# EAGLE design konashi_rev105 (EAGLE 6.3)
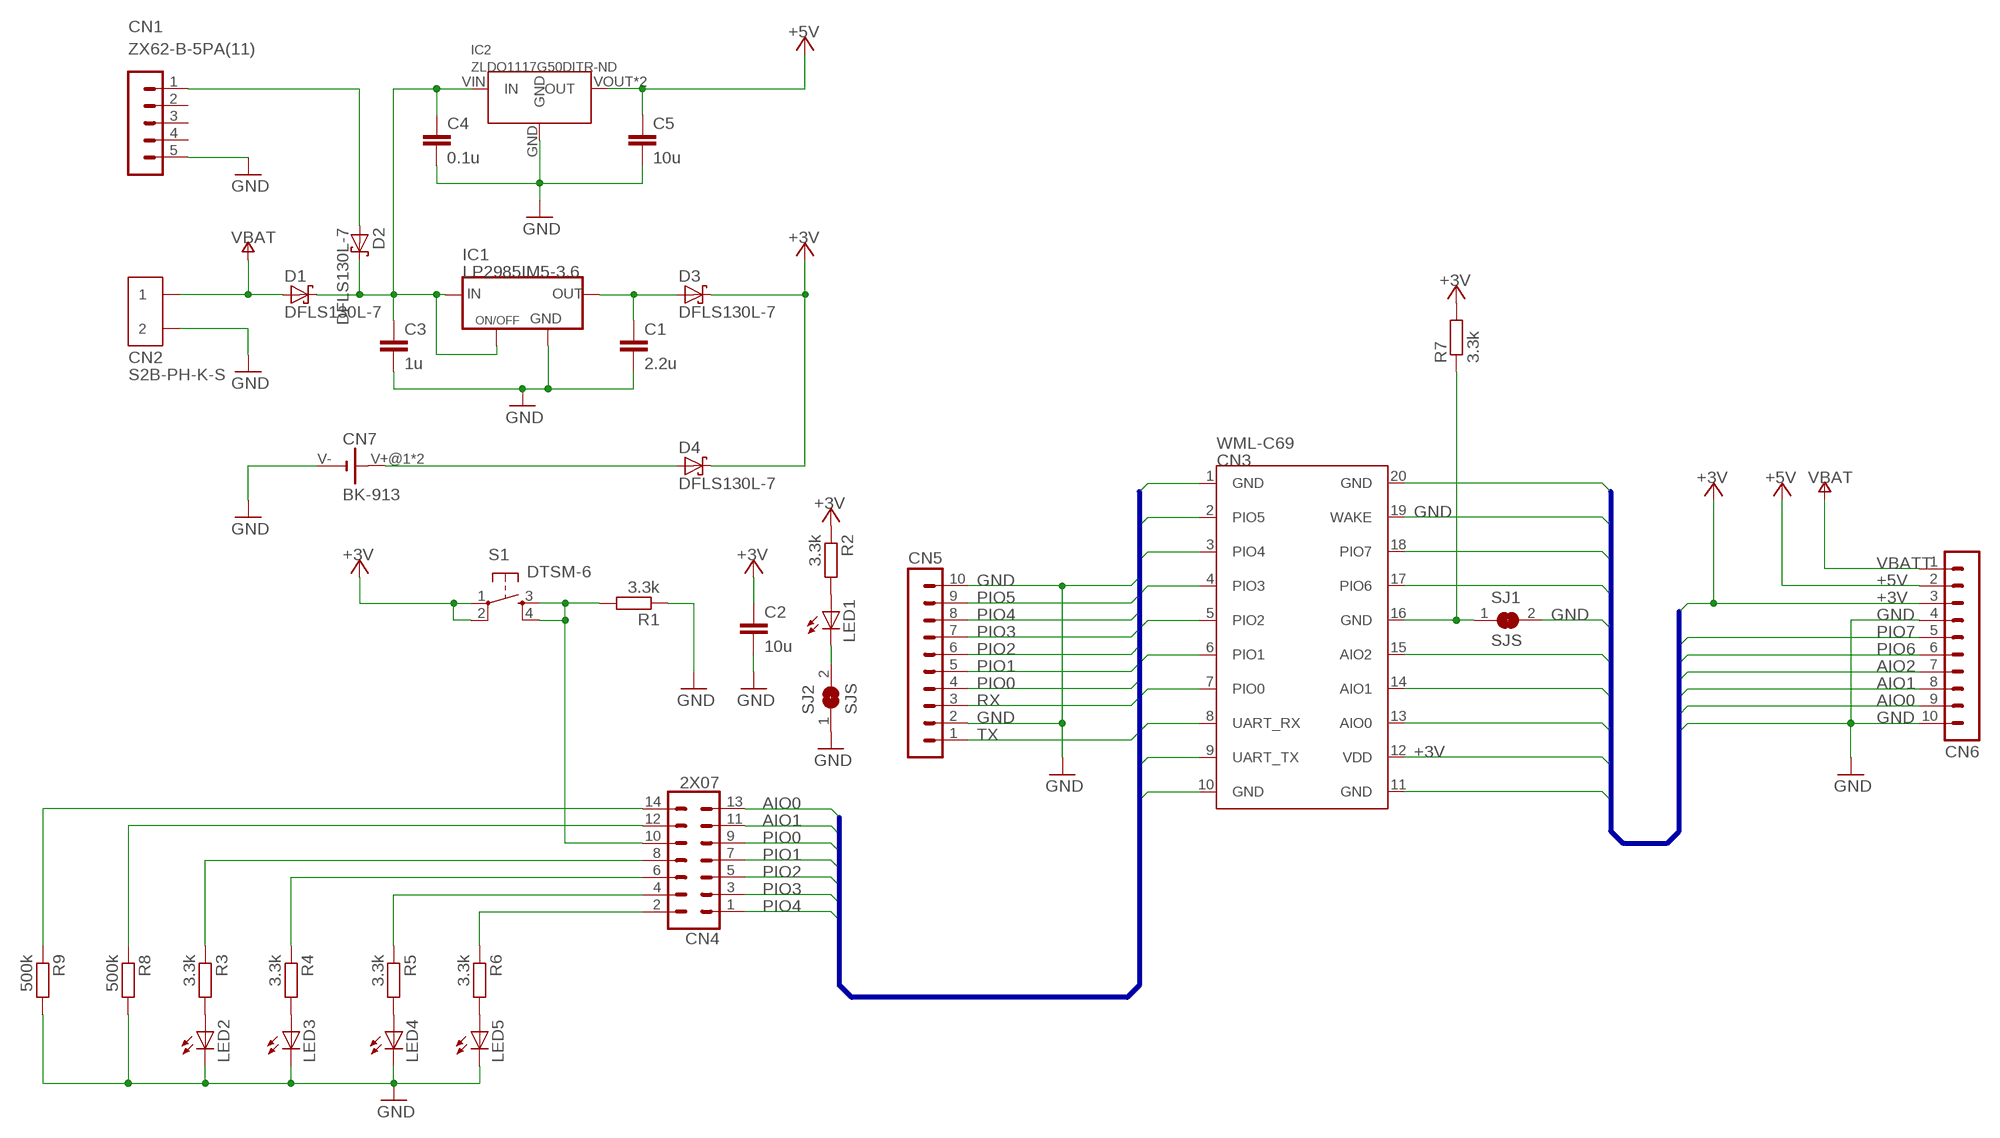
[diagram p0: schematic, sheet 1]

## Parts
C1  2.2u  C-EUC0603  [C0603]
C2  10u  C-EUC0603  [C0603]
C3  1u  C-EUC0603  [C0603]
C4  0.1u  C-EUC0603  [C0603]
C5  10u  C-EUC0603  [C0603]
CN1  ZX62-B-5PA(11)  [MICRO-B]
CN2  S2B-PH-K-S  [S2B-PH-K-S]
CN3  WML-C69  [WML-C69]
CN4  2X07  [2X07]
CN5  MA10-1  [MA10-1]
CN6  MA10-1  [MA10-1]
CN7  BK-913  [BK-913]
D1  DFLS130L-7  [DFLS130L]
D2  DFLS130L-7  [DFLS130L]
D3  DFLS130L-7  [DFLS130L]
D4  DFLS130L-7  [DFLS130L]
IC1  LP2985IM5-3.6  LP2981-30DBVR  [SOT-23]
IC2  ZLDO1117G50DITR-ND  [SOD233]
LED1  LEDCHIPLED_1206  [CHIPLED_1206]
LED2  LEDCHIPLED_1206  [CHIPLED_1206]
LED3  LEDCHIPLED_1206  [CHIPLED_1206]
LED4  LEDCHIPLED_1206  [CHIPLED_1206]
LED5  LEDCHIPLED_1206  [CHIPLED_1206]
R1  3.3k  R-EU_R0603  [R0603]
R2  3.3k  R-EU_R0603  [R0603]
R3  3.3k  R-EU_R0603  [R0603]
R4  3.3k  R-EU_R0603  [R0603]
R5  3.3k  R-EU_R0603  [R0603]
R6  3.3k  R-EU_R0603  [R0603]
R7  3.3k  R-EU_R0603  [R0603]
R8  500k  R-EU_R0603  [R0603]
R9  500k  R-EU_R0603  [R0603]
S1  DTSM-6  [DTSM-6]
SJ1  SJS  [SJS]
SJ2  SJS  [SJS]

## Nets
+3V: C2.1 CN3.12(VDD) CN6.3 D3.C D4.C R2.1 R7.2 S1.1 S1.2
+5V: C5.1 CN6.2 IC2.VOUT2(OUT) IC2.VOUT(OUT)
AIO0: CN3.13(AIO0) CN4.13 CN6.9
AIO1: CN3.14(AIO1) CN4.11 CN6.8
AIO2: CN3.15(AIO2) CN6.7
GND: C1.2 C2.2 C3.2 C4.2 C5.2 CN1.5(5.GND) CN2.P$2 CN3.1(GND) CN3.10(GND) CN3.11(GND) CN3.19(WAKE) CN3.20(GND) CN5.2 CN5.10 CN6.4 CN6.10 CN7.V-(-) IC1.2(GND) IC2.GND LED2.C LED3.C LED4.C LED5.C R1.1 R8.2 R9.2 SJ1.2 SJ2.1
N$1: LED3.A R4.2
N$2: LED2.A R3.2
N$3: LED1.C SJ2.2
N$4: CN7.V+@1(+) CN7.V+@2(+) D4.A
N$5: CN3.16(GND) R7.1 SJ1.1
N$6: C1.1 D3.A IC1.5(OUT)
N$7: CN4.12 R8.1
N$8: C3.1 C4.1 D1.C D2.C IC1.1(IN) IC1.3(ON/OFF) IC2.VIN(IN)
N$9: LED5.A R6.2
N$10: LED4.A R5.2
N$11: CN4.14 R9.1
N$13: LED1.A R2.2
N$18: CN4.10 R1.2 S1.3 S1.4
N$20: CN4.6 R4.1
N$21: CN4.2 R6.1
N$22: CN4.4 R5.1
N$23: CN4.8 R3.1
N$37: CN1.1(1.VBUS) D2.A
PIO0: CN3.7(PIO0) CN4.9 CN5.4
PIO1: CN3.6(PIO1) CN4.7 CN5.5
PIO2: CN3.5(PIO2) CN4.5 CN5.6
PIO3: CN3.4(PIO3) CN4.3 CN5.7
PIO4: CN3.3(PIO4) CN4.1 CN5.8
PIO5: CN3.2(PIO5) CN5.9
PIO6: CN3.17(PIO6) CN6.6
PIO7: CN3.18(PIO7) CN6.5
RX: CN3.8(UART_RX) CN5.3
TX: CN3.9(UART_TX) CN5.1
VBATT: CN2.P$1 CN6.1 D1.A ; supply symbol labelled VBAT
Unconnected: CN1.2(2.D-) CN1.3(3.D+) CN1.4(4.ID)

## Buses
GND,PIO[0..5],RX,TX
GND,PIO7,PIO6,AIO2,AIO1,AIO0,+3V

## Library data of the parts
C1-C5 = rcl:C-EU: CAPACITOR, European symbol
CN1 = con-USB:ZX62-B-5PA(11)
CN2 = con-jst:S2B-PH-K-S
CN3 = ble_CSR2:WML-C69
CN4 = konashi_rev105:2X07
CN5 CN6 = con-std:MA10-1: PIN HEADER; OC_FARNELL: unknown; OC_NEWARK: unknown
CN7 = con-CoinBatt:BK-913
D1-D4 = dioade:DFLS130L-7
IC1 = LDO:LP2981-30DBVR
IC2 = konashi_rev105:ZLDO1117G50DITR-ND
LED1-LED5 = led:LED: LED OSRAM: - CHIPLED LG R971, LG N971, LY N971, LG Q971, LY Q971, LO R971, LY R971 LH N974, LH R974 LS Q976, LO Q976, LY Q976 LO Q996 - Hyper CHIPLED LW Q18S LB Q993, LB Q99A, LB R99A - SideLED LS A670, LO A670, LY A670, LG A670, LP A670 LB A673, LV A673, LT A673, LW A673 LH A674 LY A675 LS A676, LA A676, LO A676, LY A676, LW A676 LS A679, LY A679, LG A679 - Hyper Micro SIDELED® LS Y876, LA Y876, LO Y876, LY Y876 LT Y87S - SmartLED LW L88C, LW L88S LB L89C, LB L89S, LG L890 LS L89K, LO L89K, LY L89K LS L896, LA L896, LO L896, LY L896 - TOPLED LS T670, LO T670, LY T670, LG T670, LP T670 LSG T670, LSP T670, LSY T670, LOP T670, LYG T670 LG T671, LOG T671, LSG T671 LB T673, LV T673, LT T673, LW T673 LH T674 LS T676, LA T676, LO T676, LY T676, LB T676, LH T676, LSB T676, LW T676 LB T67C, LV T67C, LT T67C, LS T67K, LO T67K, LY T67K, LW E67C LS E67B, LA E67B, LO E67B, LY E67B, LB E67C, LV E67C, LT E67C LW T67C LS T679, LY T679, LG T679 LS T770, LO T770, LY T770, LG T770, LP T770 LB T773, LV T773, LT T773, LW T773 LH T774 LS E675, LA E675, LY E675, LS T675 LS T776, LA T776, LO T776, LY T776, LB T776 LHGB T686 LT T68C, LB T68C - Hyper Mini TOPLED® LB M676 - Mini TOPLED Santana® LG M470 LS M47K, LO M47K, LY M47K Source: http://www.osram.convergy.de LUXEON: - LUMILED® LXK2-PW12-R00, LXK2-PW12-S00, LXK2-PW14-U00, LXK2-PW14-V00 LXK2-PM12-R00, LXK2-PM12-S00, LXK2-PM14-U00 LXK2-PE12-Q00, LXK2-PE12-R00, LXK2-PE12-S00, LXK2-PE14-T00, LXK2-PE14-U00 LXK2-PB12-K00, LXK2-PB12-L00, LXK2-PB12-M00, LXK2-PB14-N00, LXK2-PB14-P00, LXK2-PB14-Q00 LXK2-PR12-L00, LXK2-PR12-M00, LXK2-PR14-Q00, LXK2-PR14-R00 LXK2-PD12-Q00, LXK2-PD12-R00, LXK2-PD12-S00 LXK2-PH12-R00, LXK2-PH12-S00 LXK2-PL12-P00, LXK2-PL12-Q00, LXK2-PL12-R00 Source: www.luxeon.com KINGBRIGHT: KA-3528ASYC Source: www.kingbright.com
R1-R9 = rcl:R-EU_: RESISTOR, European symbol
S1 = switch-tact:DTSM-6
SJ1 SJ2 = pad:SJS

## Board
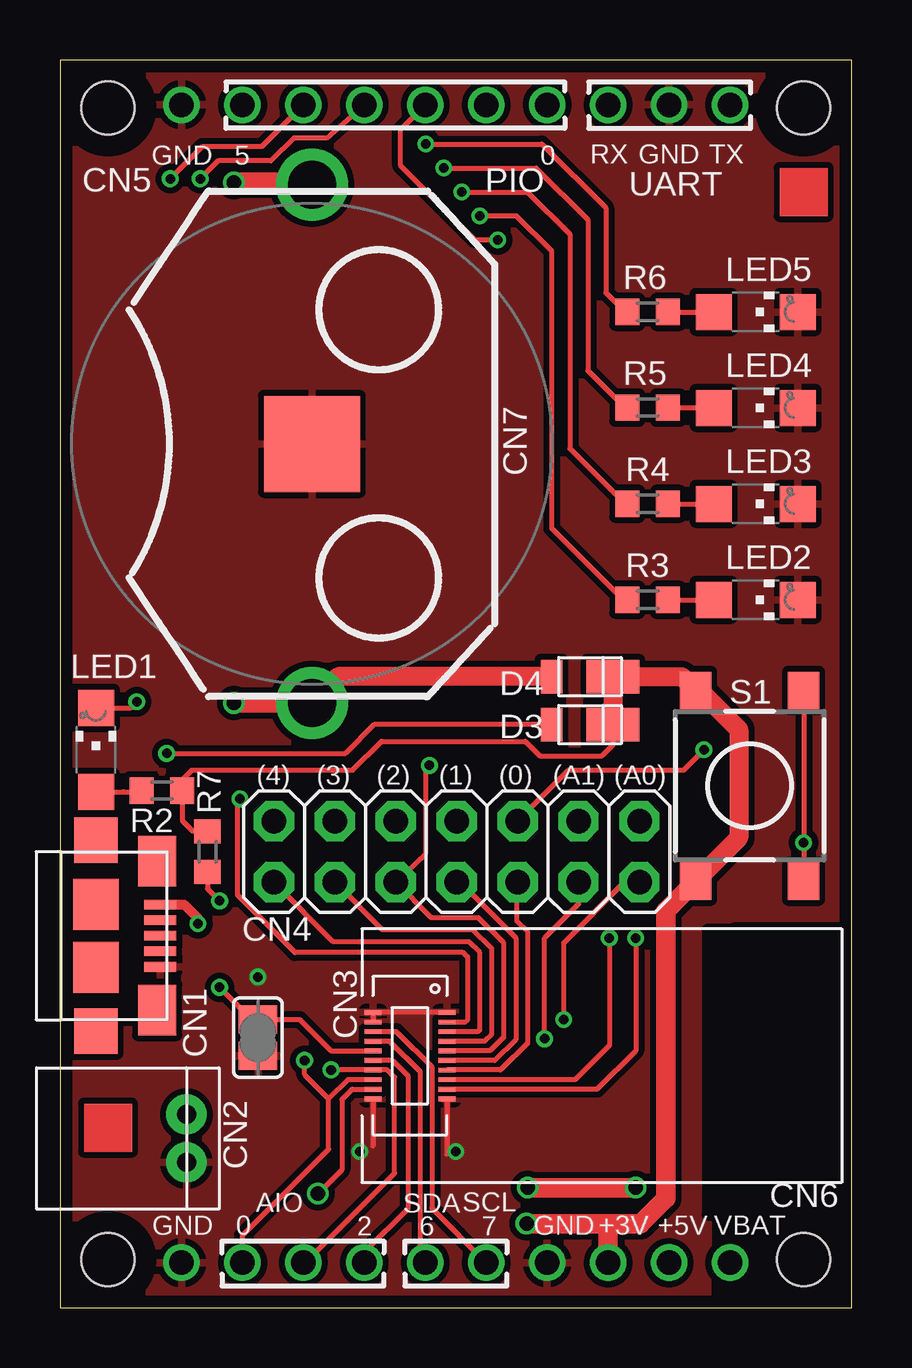
[diagram p1: board, top side]
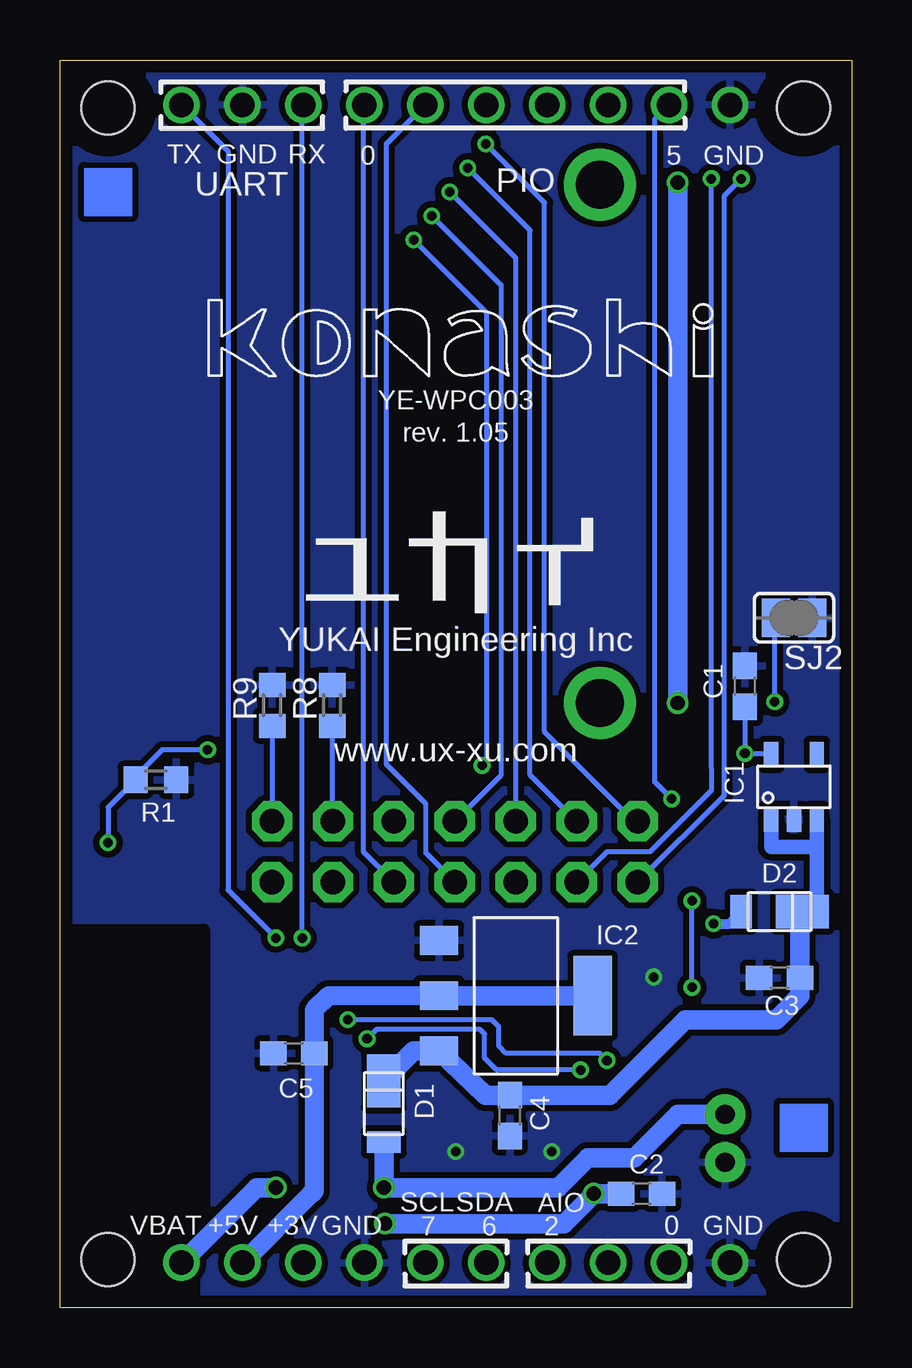
[diagram p2: board, bottom side, seen from below]

Size 33 x 52 mm. Coordinates in mm from the lower left corner, seen from the top.
Outline: 0,0 33,0 33,52 0,52 0,0
Copper layers (1*16): Top 0.035mm / dielectric 1.6mm / Bottom 0.035mm
Design rules "Elecrow_2-layer_PCB_eagle_rule": minimum track width 6mil, minimum drill 12mil, track to track 6mil, track to pad 6mil, pad to pad 6mil, via to via 8mil, smd to smd 0mil, copper to edge 20mil, drill to drill 10mil, minimum pad ring 6mil, minimum via ring 6mil, stop-mask expansion 0mil, vias tented up to drill 100mil, thermal gap 10mil
Holes 2.2 mm at 2,2 31,2 31,50 2,50
tRestrict: area 27,3.9 to 33,15.8; area 0.2,0.2 to 3.8,3.8; area 29.2,0.2 to 32.8,3.8; area 29.2,48.2 to 32.8,51.8; area 0.2,48.2 to 3.8,51.8
bRestrict: area 27,3.9 to 33,15.8; area 0.2,0.2 to 3.8,3.8; area 29.2,0.2 to 32.8,3.8; area 29.2,48.2 to 32.8,51.8; area 0.2,48.2 to 3.8,51.8

### Footprints (pad centres in the part's own frame; a part is rotated, then mirrored left to right if it is on the bottom)
C0603 = smd 1.1 x 1: 1 -0.85,0; 2 0.85,0
MICRO-B = smd 0.4 x 1.35: 1 -1.3,2.675; 2 -0.65,2.675; 3 0,2.675; 4 0.65,2.675; 5 1.3,2.675 | smd 2.1 x 1.6: P$1 3.1,2.55; P$2 -3.1,2.55 | smd 2.125 x 1.9: P$3 1.312,0; P$4 -1.312,0 | smd 1.9 x 1.8: P$5 3.975,0; P$6 -3.975,0
S2B-PH-K-S = drill 0.8 pad 1.676: P$1 1.95,-1.35; P$2 3.95,-1.35
WML-C69 = smd 0.2 x 0.7: 1 -1.8,1.54; 2 -1.4,1.54; 3 -1,1.54; 4 -0.6,1.54; 5 -0.2,1.54; 6 0.2,1.54; 7 0.6,1.54; 8 1,1.54; 9 1.4,1.54; 10 1.8,1.54; 11 1.8,-1.54; 12 1.4,-1.54; 13 1,-1.54; 14 0.6,-1.54; 15 0.2,-1.54; 16 -0.2,-1.54; 17 -0.6,-1.54; 18 -1,-1.54; 19 -1.4,-1.54; 20 -1.8,-1.54
2X07 = drill 1.016 pad 1.676 octagon: 1 -5.08,-1.27; 2 -5.08,1.27; 3 -2.54,-1.27; 4 -2.54,1.27; 5 0,-1.27; 6 0,1.27; 7 2.54,-1.27; 8 2.54,1.27; 9 5.08,-1.27; 10 5.08,1.27; 11 7.62,-1.27; 12 7.62,1.27; 13 10.16,-1.27; 14 10.16,1.27
MA10-1 = drill 1.016: 1 -11.43,0; 2 -8.89,0; 3 -6.35,0; 4 -3.81,0; 5 -1.27,0; 6 1.27,0; 7 3.81,0; 8 6.35,0; 9 8.89,0; 10 11.43,0
BK-913 = drill 2: V+@1 -10.8,0; V+@2 10.8,0 | smd 4 x 4: V- 0,0
DFLS130L = smd 0.9 x 1.4: A 1.6,0 | smd 2.2 x 1.4: C -0.95,0
SOT-23 = smd 0.6 x 1.05: 1 -0.95,-1.35; 2 0,-1.35; 3 0.95,-1.35; 4 0.95,1.35; 5 -0.95,1.35
SOD233 = smd 1.2 x 1.6: GND -2.3,-3.2; VIN 2.3,-3.2; VOUT 0,-3.2 | smd 3.3 x 1.6: VOUT2 0,3.2
CHIPLED_1206 = smd 1.5 x 1.5: A 0,-1.75; C 0,1.75
R0603 = smd 1 x 1.1: 1 -0.85,0; 2 0.85,0
DTSM-6 = smd 1.55 x 1.3: 1 -3.975,2.25; 2 3.975,2.25; 3 -3.975,-2.25; 4 3.975,-2.25
SJS = smd 1.168 x 1.6: 1 -0.762,0; 2 0.762,0

### Placement (x,y rotation side)
C1  4.44,25.9 90 bottom
C2  8.75,4.75 0 bottom
C3  3,13.75 180 bottom
C4  14.25,8 270 bottom
C5  23.25,10.6 180 bottom
CN1  1.5,15.5 270 top
CN2  6.62,10 270 top
CN3  14.59,10.5 270 top
CN4  14,19 0 top
CN5  16.5,50.13 180 top
CN6  16.5,1.87 180 top
CN7  10.5,36 270 top
D1  19.5,8.5 270 bottom
D2  3,16.5 180 bottom
D3  22.1,24.3 180 top
D4  22.1,26.3 180 top
IC1  2.4,21.7 0 bottom
IC2  14,13 270 bottom
LED1  1.5,23.25 0 top
LED2  29,29.5 270 top
LED3  29,33.5 270 top
LED4  29,37.5 270 top
LED5  29,41.5 270 top
R1  29,22 180 bottom
R2  4.25,21.55 180 top
R3  24.5,29.5 0 top
R4  24.5,33.5 0 top
R5  24.5,37.51 0 top
R6  24.5,41.5 0 top
R7  6.15,19 90 top
R8  21.65,25.1 90 bottom
R9  24.15,25.1 90 bottom
S1  28.75,21.75 90 top
SJ1  8.25,11.25 270 top
SJ2  2.4,28.75 180 bottom
U$13  [KONASHI_LOGO_WIRE]  16,40.1 0 bottom
U$14  [YUKAILOGO]  16.5,31.1 0 bottom

### Tracks (layer width: path | path; a pad name or v marks a point on that pad's centre or on a via)
+3V  (via drill 0.6)
  Top 0.2: R7.2 5.55,19.85 5.1,20.3 R2.1 5.1,22 5.5,22.4 12.2,22.4 13.4,23.6 19.4,23.6 20,23 22.6,23 23.05,23.45 D3.C
  Top 0.203: v10.75,4.75 11.75,5.75 11.75,8.67 12.18,9.1 CN3.12
  Top 0.8: S1.1 28.3,19.57 28.3,24.1 26.68,25.73 S1.2 25.93,26.3 D4.C D3.C
  Top 0.813: CN6.3 22.85,3.5 | 22.85,3.5 v19.45,3.5 | 22.85,3.5 24.19,3.5 25.25,4.56 25.25,16.52 S1.1
  Bottom 0.813: C2.1 v10.75,4.75 12,3.5 v19.45,3.5
+5V
  Bottom 0.8: IC2.VOUT 21.8,13 22.4,12.4 C5.1 22.4,4.86 22.53,4.73
  Bottom 0.813: IC2.VOUT IC2.VOUT2 | CN6.2 22.53,4.73 22.45,4.81
AIO0  (via drill 0.4)
  Top 0.2: CN3.13 12,9.5 11.2,8.7 | v10.2,10.3 10.2,9.7 11.2,8.7 | v21,12 21,15.2 23.53,17.73 CN4.13 | CN6.9 7.61,3.01 11.2,6.6 11.2,8.7
  Bottom 0.2: v10.2,10.3 10.5,10.6 14.4,10.6 14.7,10.9 14.7,11.7 15,12 v21,12
AIO1  (via drill 0.4)
  Top 0.2: v11.3,9.9 CN3.14 13.65,9.9 13.95,9.6 13.95,5.6 10.22,1.87 CN6.8 | v20.2,11.2 20.2,15.4 21.62,16.82 CN4.11
  Bottom 0.2: v11.3,9.9 14.8,9.9 15.3,10.4 15.3,11.4 15.5,11.6 19.8,11.6 v20.2,11.2
AIO2
  Top 0.203: CN6.7 12.69,2.31 14.5,4.12 14.5,9.66 13.86,10.3 CN3.15
GND  (via drill 0.4)
  Top 0.2: CN3.1 CN3.20
  Top 0.203: CN3.20 CN3.19 | CN3.11 13.05,6.73 | CN3.10 16.13,6.39
  other vias: 12.5,6.5 16.5,6.5 8.25,13.78
  pour Top (isolate 0.254): 0.25,51.75 32.75,51.75 32.75,15.75 27.12,15.75 27,0.25 0.25,0.25
  pour Bottom (isolate 0.254): 0.25,51.75 32.75,51.75 32.75,15.75 27.12,15.75 27,0.25 0.25,0.25
N$1
  Top 0.203: R4.2 LED3.A
N$2
  Top 0.203: R3.2 LED2.A
N$3  (via drill 0.4)
  Top 0.2: LED1.C 2.95,25 v3.2,25.25
  Bottom 0.2: v3.2,25.25 3.2,28.71 SJ2.2
N$4  (via drill 0.6)
  Top 0.8: D4.A 11.6,26.3 CN7.V+@2 v7.25,25.2
  Top 0.813: v7.25,46.9 10.4,46.9 CN7.V+@1
  Bottom 0.813: v7.25,25.2 v7.25,46.9
N$5  (via drill 0.4)
  Top 0.2: R7.1 6.15,17.45 v6.65,16.95
  Top 0.203: v6.65,13.35 7.99,12.01 SJ1.1 10,12 11.31,10.69 11.32,10.7 CN3.16
  Bottom 0.203: v6.65,13.35 v6.65,16.95
N$6  (via drill 0.4)
  Top 0.2: v4.45,23.1 11.9,23.1 13.1,24.3 D3.A
  Bottom 0.2: IC1.5 3.4,23.1 v4.45,23.1 v4.44,23.11 C1.1
N$7
  Bottom 0.2: R8.1 21.65,20.3 CN4.12
N$8
  Bottom 0.61: 1.8,16.5 D2.C 1.45,16.5 1.45,19.2 | IC1.3 1.45,19.2 | IC1.1 3.35,19.2 1.45,19.2
  Bottom 0.813: D2.C 2.15,16.5 C3.1 2.15,12.99 3.14,12 6.92,12 10.07,8.85 C4.1 15.26,8.85 IC2.VIN 18.26,10.69 D1.C
N$9
  Top 0.203: R6.2 LED5.A
N$10
  Top 0.203: R5.2 LED4.A
N$11
  Bottom 0.2: R9.1 CN4.14
N$13
  Top 0.2: 2.65,21.5 3.35,21.5 R2.2
  Top 0.203: LED1.A 2.65,21.5
N$18  (via drill 0.4)
  Top 0.2: CN4.10 21.2,22.4 26,22.4 v26.85,23.25
  Top 0.203: S1.3 v31,19.38 S1.4
  Bottom 0.2: v26.85,23.25 28.75,23.25
  Bottom 0.203: v31,19.38 31,20.85 R1.2 30,22 28.75,23.25
N$20  (via drill 0.4)
  Top 0.203: v16.75,46.5 19.48,46.5 21.25,44.73 21.25,35.8 23.65,33.4 R4.1
  Bottom 0.2: CN4.6 14,43.75 v16.75,46.5
N$21  (via drill 0.4)
  Top 0.203: v15.25,48.5 20.09,48.5 22.75,45.84 22.75,42.3 23.65,41.4 R6.1
  Bottom 0.2: CN4.2 9.07,20.27 12.8,24 12.8,46.05 v15.25,48.5
N$22  (via drill 0.4)
  Top 0.203: R5.1 23.65,37.4 22,39.05 22,45.35 19.85,47.5 v16,47.5
  Bottom 0.2: CN4.4 13.4,22.2 13.4,44.9 v16,47.5
N$23  (via drill 0.4)
  Top 0.203: R3.1 23.65,29.32 20.5,32.48 20.5,44.04 19.04,45.5 v17.5,45.5
  Bottom 0.2: CN4.8 14.6,22.2 14.6,42.6 v17.5,45.5
N$37  (via drill 0.4)
  Top 0.406: CN1.1 5.17,16.8 5.75,16.22 v5.75,16
  Bottom 0.406: v5.75,16 5.1,16 D2.A
PIO0
  Top 0.2: 19.5,11.04 19.5,15.65 19.05,16.1 19.05,17.7 CN4.9
  Top 0.203: 19.5,11.04 18.36,9.9 CN3.7
  Bottom 0.2: CN4.9 20.35,19 20.35,50.09 CN5.4
PIO1
  Top 0.2: CN4.7 16.67,17.73 19,15.4 19,11.17
  Top 0.203: 19,11.17 18.13,10.3 CN3.6
  Bottom 0.2: CN5.5 19.4,48.5 19.4,22.65 18.57,21.82
  Bottom 0.203: CN4.7 17.75,18.94 17.75,21 18.57,21.82 18.75,22
PIO2  (via drill 0.4)
  Top 0.2: 17.44,16.25 15.48,16.25 CN4.5 | v18.25,44.5 17.3,44.5 14.2,47.6 14.2,49.1 14.23,49.13 | 15.25,18.93 15.25,22.45 v15.4,22.6
  Top 0.203: 17.44,16.25 18.5,15.19 18.5,11.28 17.92,10.7 CN3.5 | CN4.5 15.25,18.93 | 14.23,49.13 CN5.6
  Bottom 0.2: v18.25,44.5 15.2,41.45 15.2,22.85 15.4,22.65 v15.4,22.6
PIO3  (via drill 0.4)
  Top 0.2: 17.2,15.75 13.44,15.75 CN4.3 | 11.11,48.75 9.75,48.75 8.8,47.8 6.6,47.8 v5.85,47.05
  Top 0.203: 17.2,15.75 18,14.95 18,11.39 17.71,11.1 CN3.4 | 11.11,48.75 CN5.7
  Bottom 0.2: 5.85,22.5 5.85,21.55 8.4,19 10.19,19
  Bottom 0.203: 10.19,19 CN4.3 | 5.85,22.5 v5.85,47.05
PIO4  (via drill 0.4)
  Top 0.2: v4.6,47.05 5.95,48.4 8.42,48.4 CN5.8
  Top 0.203: CN4.1 11.39,15.25 17.05,15.25 17.5,14.8 17.5,11.59 17.41,11.5 CN3.3
  Bottom 0.2: CN4.1 5.3,21.35 5.3,46.35 v4.6,47.05
PIO5  (via drill 0.4)
  Top 0.2: CN3.2 16.9,11.9 17,12 17,14.6 16.8,14.8 9.8,14.8 7.4,17.2 7.4,21.1 v7.5,21.2
  Bottom 0.2: CN5.9 8.2,49.54 8.2,21.9 v7.5,21.2
PIO6
  Top 0.203: CN6.6 15.23,2.25 15,2.45 15,9.85 13.75,11.1 CN3.17
PIO7
  Top 0.203: CN6.5 15.5,4.14 15.5,10.03 14.03,11.5 CN3.18
RX  (via drill 0.4)
  Top 0.2: v22.9,15.4 22.9,10.93 21.47,9.5
  Top 0.203: 21.47,9.5 CN3.8
  Bottom 0.203: v22.9,15.4 22.9,50.13 CN5.3
TX  (via drill 0.4)
  Top 0.2: v24,15.4 24,10.71 22.39,9.1
  Top 0.203: 22.39,9.1 CN3.9
  Bottom 0.2: CN5.1 26,48.2 26,17.4 v24,15.4
VBATT  (via drill 0.6)
  Top 0.813: v24,5 v19.5,5
  Bottom 0.813: v24,5 24.8,5 CN6.1 | D1.A v19.5,5 12.25,5 11,6.25 9.05,6.25 7.25,8.05 CN2.P$1
(copper drawn outside any net)
  shapes: Bottom area x2, Top area x2

### Text on the board
tPlace: GND | 5 | PIO | 0 | RX | GND | TX | UART | AIO | SDA | SCL | GND | 0 | 2 | 6 | 7 | GND | +3V | +5V | VBAT
bPlace: GND | 5 | PIO | 0 | RX | GND | TX | UART | YE-WPC003 | rev. 1.05 | YUKAI Engineering Inc | www.ux-xu.com | AIO | SDA | SCL | GND | 0 | 2 | 6 | 7 | GND | +3V | +5V | VBAT
tNames: (4) | (3) | (2) | (1) | (0) | (A1) | (A0)